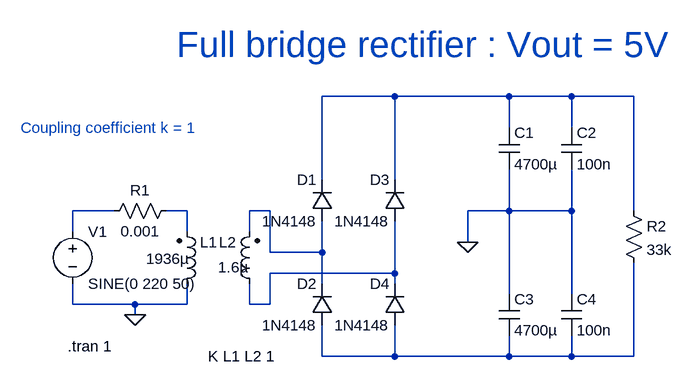
[diagram p0: schematic Full_wave_Bridge_Rectifier_5V.asc]
Full_wave_Bridge_Rectifier_5V.asc, the LTspice schematic file:
Version 4
SHEET 1 912 680
WIRE 496 -48 384 -48
WIRE 672 -48 496 -48
WIRE 768 -48 672 -48
WIRE 864 -48 768 -48
WIRE 672 0 672 -48
WIRE 768 0 768 -48
WIRE 384 80 384 -48
WIRE 496 80 496 -48
WIRE 64 128 0 128
WIRE 176 128 144 128
WIRE 304 128 272 128
WIRE 672 128 672 64
WIRE 672 128 608 128
WIRE 768 128 768 64
WIRE 768 128 672 128
WIRE 864 128 864 -48
WIRE 0 160 0 128
WIRE 176 160 176 128
WIRE 272 160 272 128
WIRE 608 176 608 128
WIRE 304 192 304 128
WIRE 384 192 384 144
WIRE 384 192 304 192
WIRE 496 224 496 144
WIRE 496 224 304 224
WIRE 384 240 384 192
WIRE 496 240 496 224
WIRE 672 256 672 128
WIRE 768 256 768 128
WIRE 0 272 0 240
WIRE 96 272 0 272
WIRE 176 272 176 240
WIRE 176 272 96 272
WIRE 272 272 272 240
WIRE 304 272 304 224
WIRE 304 272 272 272
WIRE 96 288 96 272
WIRE 384 352 384 304
WIRE 496 352 496 304
WIRE 496 352 384 352
WIRE 672 352 672 320
WIRE 672 352 496 352
WIRE 768 352 768 320
WIRE 768 352 672 352
WIRE 864 352 864 208
WIRE 864 352 768 352
FLAG 96 288 0
FLAG 608 176 0
SYMBOL voltage 0 144 R0
WINDOW 123 0 0 Left 0
WINDOW 39 0 0 Left 0
SYMATTR InstName V1
SYMATTR Value SINE(0 220 50)
SYMBOL res 160 112 R90
WINDOW 0 0 56 VBottom 2
WINDOW 3 32 56 VTop 2
SYMATTR InstName R1
SYMATTR Value 0.001
SYMBOL ind2 160 256 M180
WINDOW 0 36 80 Left 2
WINDOW 3 -47 54 Left 2
SYMATTR InstName L1
SYMATTR Value 1936µ
SYMATTR Type ind
SYMBOL ind2 288 256 R180
WINDOW 0 36 80 Left 2
WINDOW 3 17 41 Left 2
SYMATTR InstName L2
SYMATTR Value 1.6µ
SYMATTR Type ind
SYMBOL diode 400 144 R180
WINDOW 0 24 64 Left 2
WINDOW 3 24 0 Left 2
SYMATTR InstName D1
SYMATTR Value 1N4148
SYMBOL diode 400 304 R180
WINDOW 0 24 64 Left 2
WINDOW 3 24 0 Left 2
SYMATTR InstName D2
SYMATTR Value 1N4148
SYMBOL diode 512 144 R180
WINDOW 0 24 64 Left 2
WINDOW 3 24 0 Left 2
SYMATTR InstName D3
SYMATTR Value 1N4148
SYMBOL diode 512 304 R180
WINDOW 0 24 64 Left 2
WINDOW 3 24 0 Left 2
SYMATTR InstName D4
SYMATTR Value 1N4148
SYMBOL cap 656 0 R0
SYMATTR InstName C1
SYMATTR Value 4700µ
SYMBOL cap 752 0 R0
SYMATTR InstName C2
SYMATTR Value 100n
SYMBOL cap 656 256 R0
SYMATTR InstName C3
SYMATTR Value 4700µ
SYMBOL cap 752 256 R0
SYMATTR InstName C4
SYMATTR Value 100n
SYMBOL res 848 112 R0
SYMATTR InstName R2
SYMATTR Value 33k
TEXT 208 352 Left 2 !K L1 L2 1
TEXT -8 336 Left 2 !.tran 1
TEXT -80 0 Left 2 ;Coupling coefficient k = 1
TEXT 160 -128 Left 5 ;Full bridge rectifier : Vout = 5V

The netlist it stands for:
* Full_wave_Bridge_Rectifier_5V.asc
V1 N002 0 SINE(0 220 50)
R1 N003 N002 0.001
L1 0 N003 1936µ
L2 N005 N004 1.6µ
D1 N004 N001 1N4148
D2 N006 N004 1N4148
D3 N005 N001 1N4148
D4 N006 N005 1N4148
C1 N001 0 4700µ
C2 N001 0 100n
C3 0 N006 4700µ
C4 0 N006 100n
R2 N001 N006 33k
.model D D
.lib standard.dio
K L1 L2 1
.tran 1
* Coupling coefficient k = 1
* Full bridge rectifier : Vout = 5V
.backanno
.end